# EAGLE design EHcircuit_v3.1 (EAGLE 9.1.0)
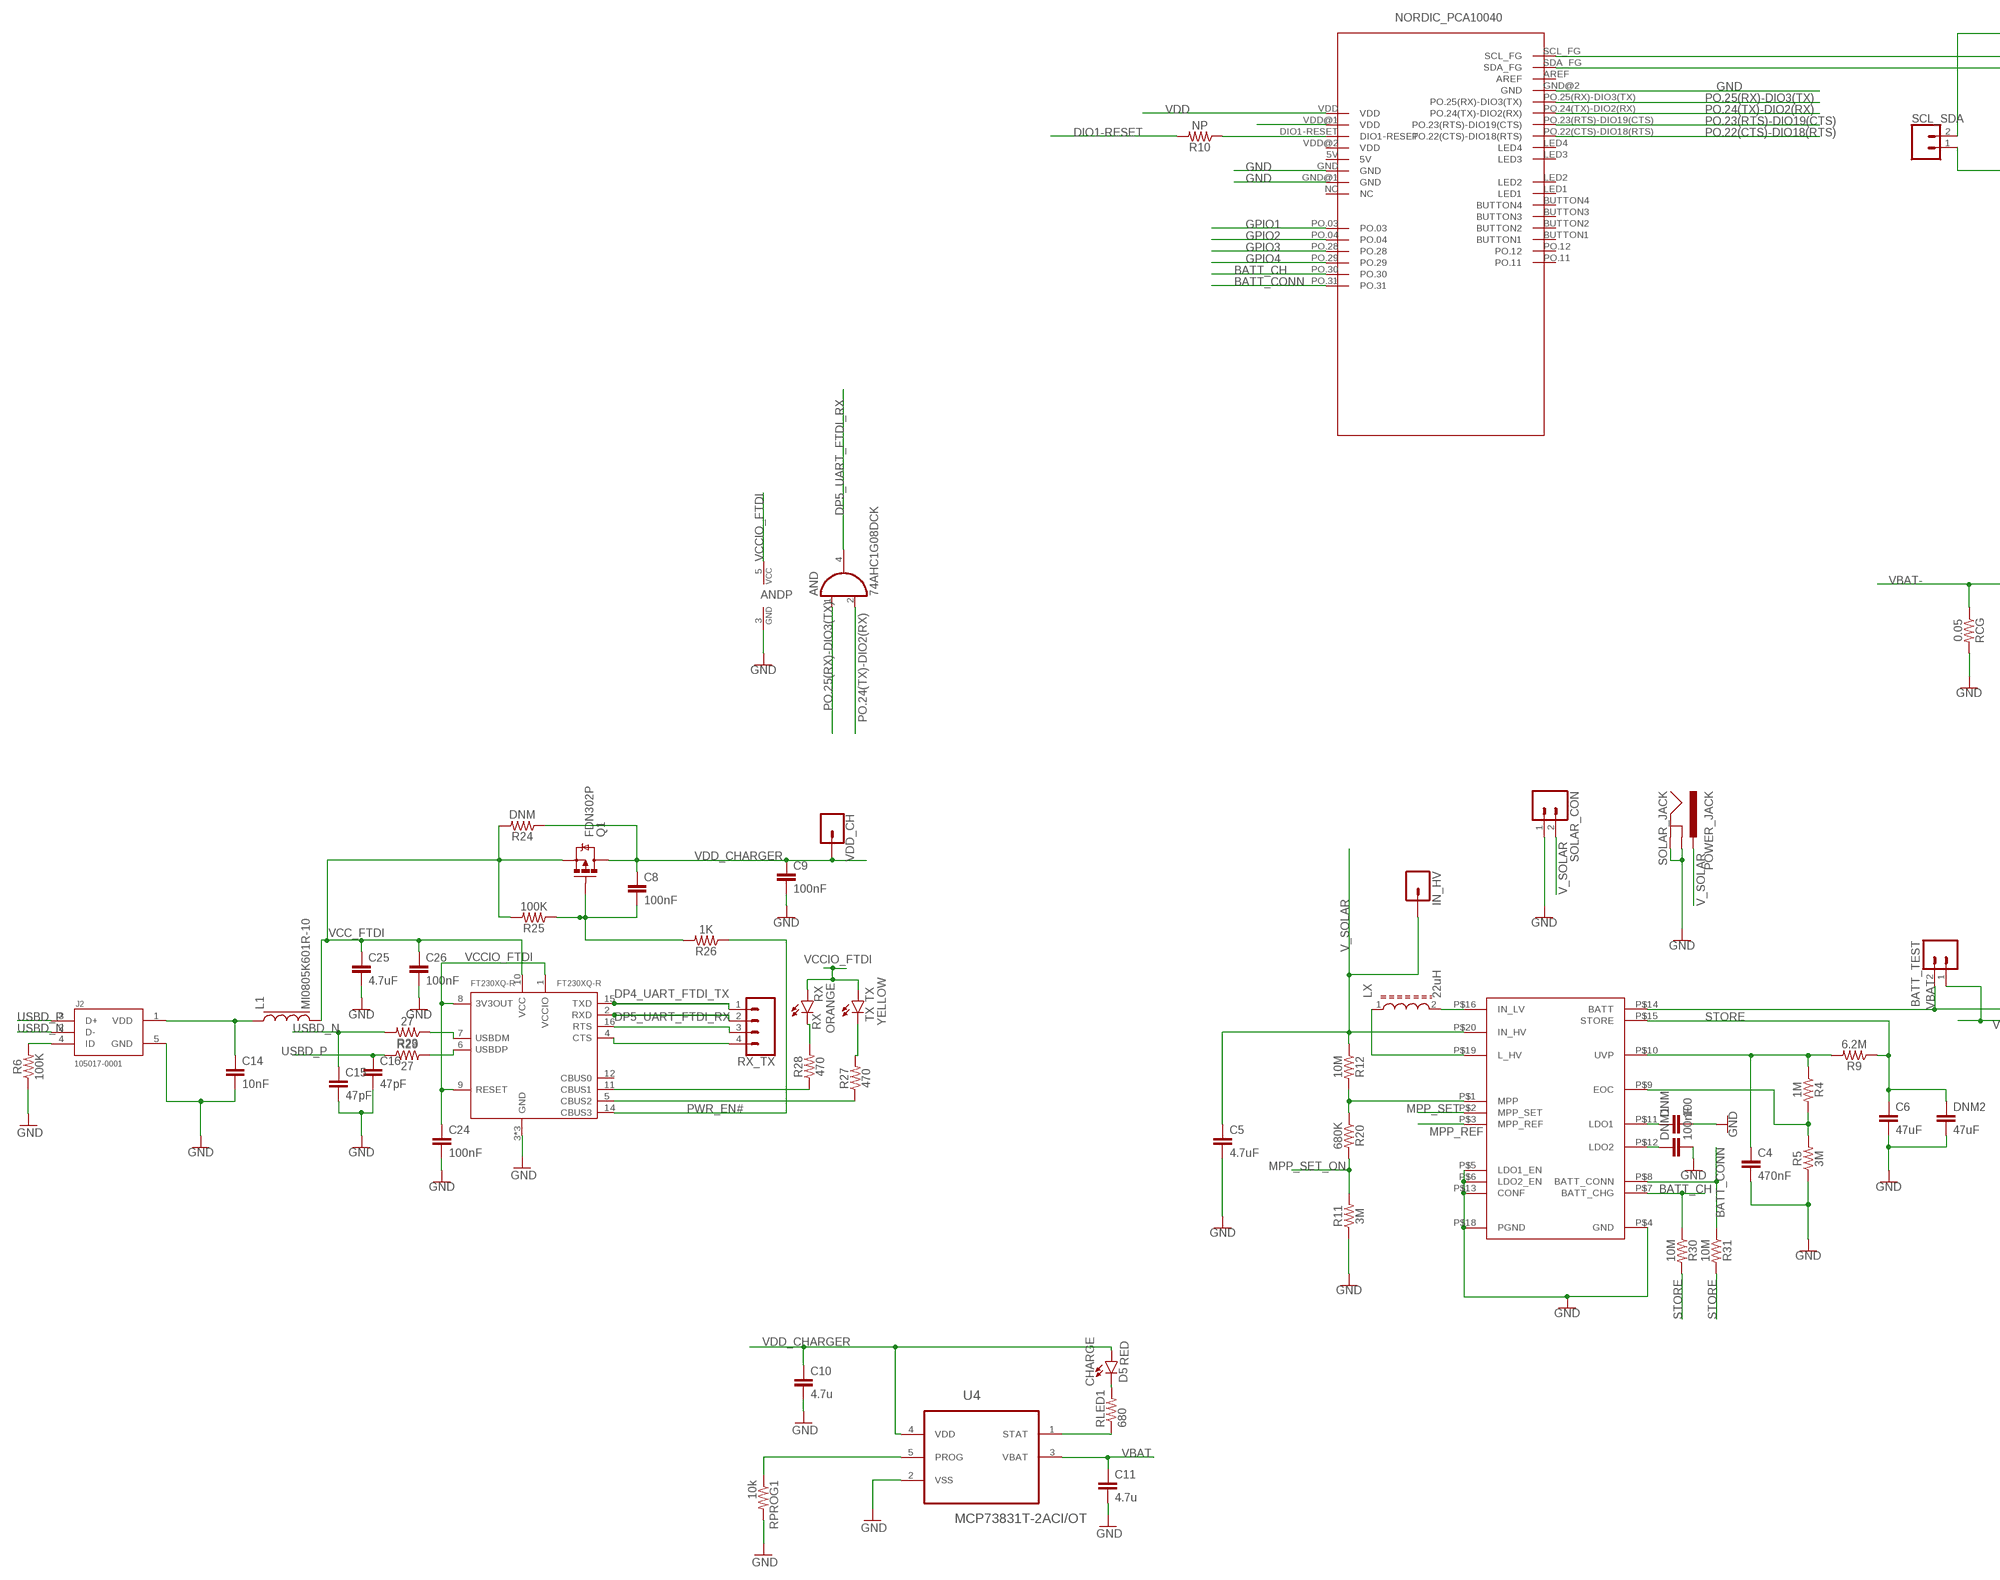
[diagram p0: schematic, sheet 1, part 1 of 2]
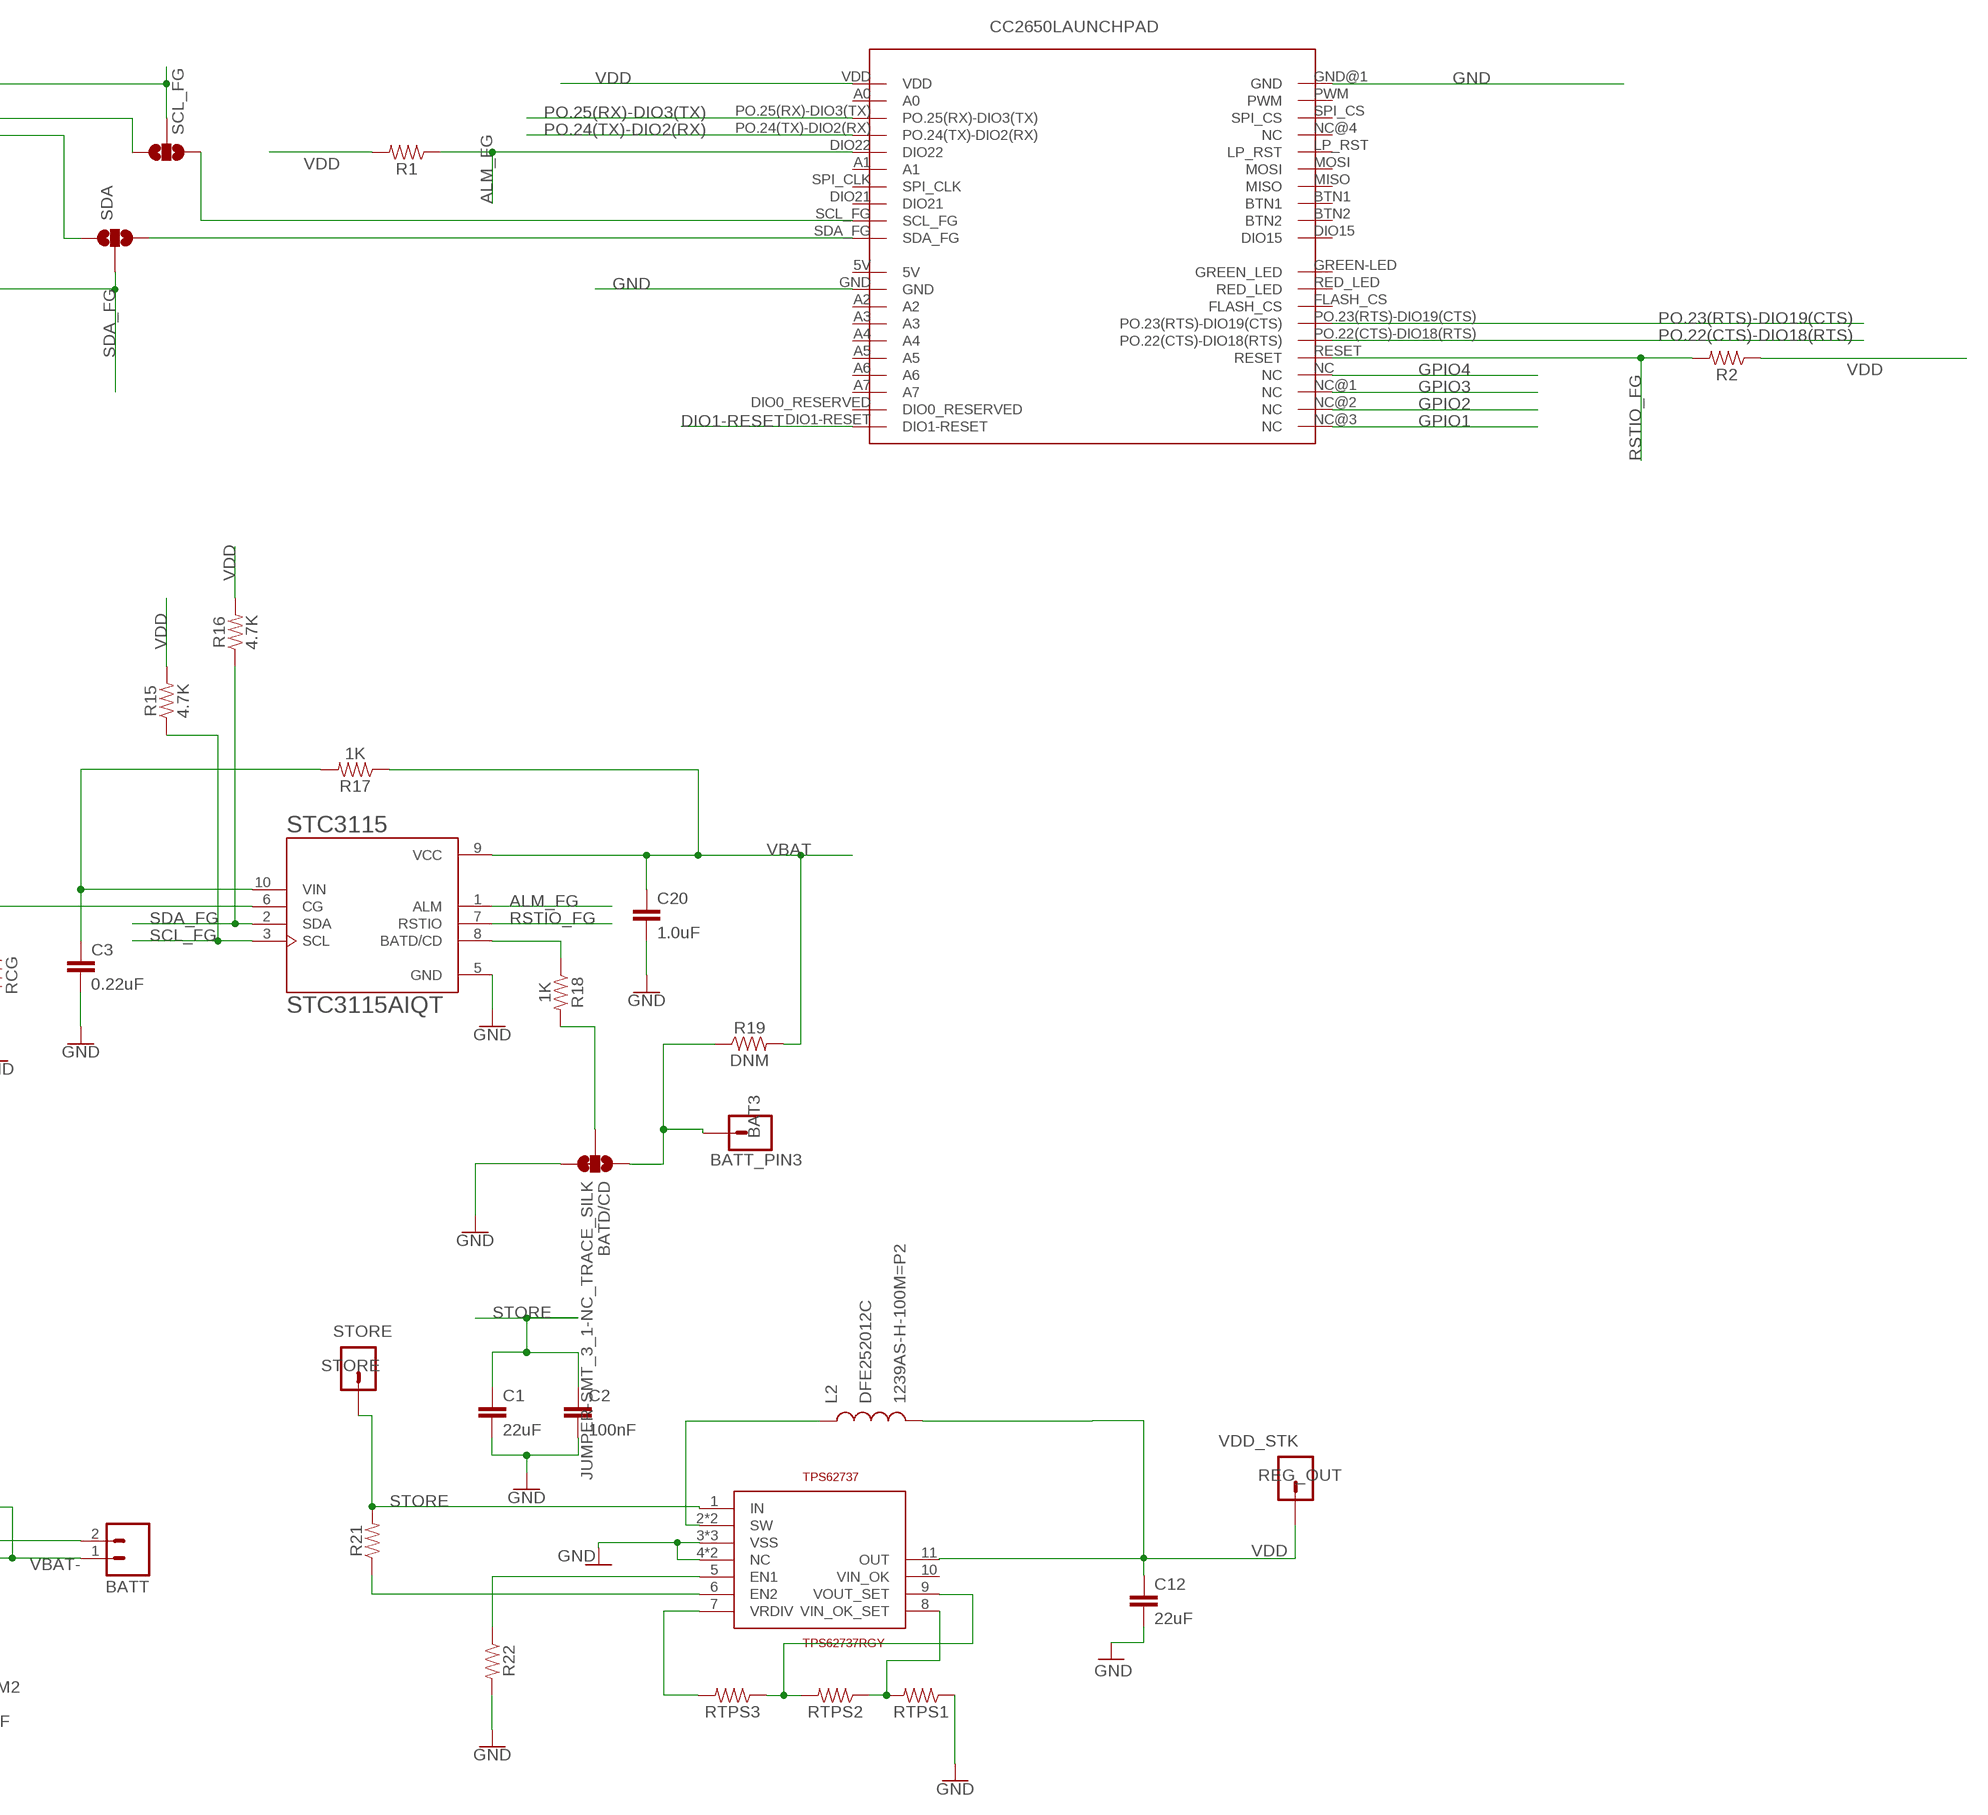
[diagram p1: schematic, sheet 1, part 2 of 2]

## Parts
AND  74AHC1G08DCK  [SC70-5]
BAT3  M01PTH  [1X01]
BATD/CD  JUMPER-SMT_3_1-NC_TRACE_SILK  [SMT-JUMPER_3_1-NC_TRACE_SILK]
BATT  M02-JST-2MM-SMT  [JST-2-SMD]
BATT_TEST  M02PTH  [1X02]
C1  22uF  10UF-0805-10V-10%  [0805@1]
C2  100nF  10UF-0805-10V-10%  [0805@1]
C3  0.22uF  10UF-0805-10V-10%  [0805@1]
C4  470nF  10UF-0805-10V-10%  [0805@1]
C5  4.7uF  10UF-0805-10V-10%  [0805@1]
C6  47uF  10UF-0805-10V-10%  [0805@1]
C8  100nF  10UF-0805-10V-10%  [0805@1]
C9  100nF  10UF-0805-10V-10%  [0805@1]
C10  4.7u  CAP0603-CAP  [0603-CAP]
C11  4.7u  CAP0603-CAP  [0603-CAP]
C12  22uF  10UF-0805-10V-10%  [0805@1]
C14  10nF  10UF-0805-10V-10%  [0805@1]
C15  47pF  10UF-0805-10V-10%  [0805@1]
C16  47pF  10UF-0805-10V-10%  [0805@1]
C20  1.0uF  10UF-0805-10V-10%  [0805@1]
C24  100nF  10UF-0805-10V-10%  [0805@1]
C25  4.7uF  10UF-0805-10V-10%  [0805@1]
C26  100nF  10UF-0805-10V-10%  [0805@1]
D5  RED  LED0603  [LED-0603]
DNM  100  10UF-0805-10V-10%  [0805@1]
DNM1  100nF  10UF-0805-10V-10%  [0805@1]
DNM2  47uF  10UF-0805-10V-10%  [0805@1]
FT230XQ-R  FT230XQ-R  FT230XQ_2  [QFN16]
IN_HV  M01PTH  [1X01]
J2  105017-0001  [MOLEX_105017-0001]
L1  MI0805K601R-10  FERRITE_BREAD  [0805]
L2  1239AS-H-100M=P2  DFE252012C  [DFE252012C]
LX  22uH  SRN4018-150M  [INDP4040X180N]
Q1  FDN302P  [SOT23-3]
R1  0.3OHM-0805-1/8W-1%  [0805@1]
R2  0.3OHM-0805-1/8W-1%  [0805@1]
R4  1M  0.3OHM-0805-1/8W-1%  [0805@1]
R5  3M  0.3OHM-0805-1/8W-1%  [0805@1]
R6  100K  0.3OHM-0805-1/8W-1%  [0805@1]
R9  6.2M  0.3OHM-0805-1/8W-1%  [0805@1]
R10  NP  0.3OHM-0805-1/8W-1%  [0805@1]
R11  3M  0.3OHM-0805-1/8W-1%  [0805@1]
R12  10M  0.3OHM-0805-1/8W-1%  [0805@1]
R15  4.7K  0.3OHM-0805-1/8W-1%  [0805@1]
R16  4.7K  0.3OHM-0805-1/8W-1%  [0805@1]
R17  1K  0.3OHM-0805-1/8W-1%  [0805@1]
R18  1K  0.3OHM-0805-1/8W-1%  [0805@1]
R19  DNM  0.3OHM-0805-1/8W-1%  [0805@1]
R20  680K  0.3OHM-0805-1/8W-1%  [0805@1]
R21  0.3OHM-0805-1/8W-1%  [0805@1]
R22  0.3OHM-0805-1/8W-1%  [0805@1]
R23  27  0.3OHM-0805-1/8W-1%  [0805@1]
R24  DNM  0.3OHM-0805-1/8W-1%  [0805@1]
R25  100K  0.3OHM-0805-1/8W-1%  [0805@1]
R26  1K  0.3OHM-0805-1/8W-1%  [0805@1]
R27  470  0.3OHM-0805-1/8W-1%  [0805@1]
R28  470  0.3OHM-0805-1/8W-1%  [0805@1]
R29  27  0.3OHM-0805-1/8W-1%  [0805@1]
R30  10M  0.3OHM-0805-1/8W-1%  [0805@1]
R31  10M  0.3OHM-0805-1/8W-1%  [0805@1]
RB2  CC2650LAUNCHPAD  [SEPS_RB]
RCG  0.05  0.3OHM-0805-1/8W-1%  [0805@1]
REG_OUT  M01PTH  [1X01]
RLED1  680  RESISTOR0603-RES  [0603-RES]
RPROG1  10k  RESISTOR0603-RES  [0603-RES]
RTPS1  0.3OHM-0805-1/8W-1%  [0805@1]
RTPS2  0.3OHM-0805-1/8W-1%  [0805@1]
RTPS3  0.3OHM-0805-1/8W-1%  [0805@1]
RX  ORANGE  LED0603  [LED-0603]
RX_TX  CONN_04  [1X04]
SCL  JUMPER-SMT_3_0_SILK  [SMT-JUMPER_3_0_NC_TRACE_SILK]
SCL_SDA  CONN_02  [1X02@2]
SDA  JUMPER-SMT_3_0_SILK  [SMT-JUMPER_3_0_NC_TRACE_SILK]
SOLAR_CON  M023.5MM  [SCREWTERMINAL-3.5MM-2]
SOLAR_JACK  POWER_JACK  [POWER_JACK_PTH]
SPV1050  SPV1050  [SPV1050]
STC3115  STC3115AIQT  [SON50P200X300X60-10]
STORE  M01PTH  [1X01]
TPS62737  TPS62737RGY  [QFN14]
TX  YELLOW  LED0603  [LED-0603]
U4  MCP73831T-2ACI/OT  [SOT95P280X145-5N]
U$1  PCA10040NORDIC  [SEPS_BB]
VDD_CH  CONN_01  [1X01@2]

## Nets
ALM_FG: R1.1 RB2.DIO22 STC3115.1(ALM)
BATT_CH: R30.1 SPV1050.P$7(BATT_CHG) U$1.PO.30
BATT_CONN: R31.1 SPV1050.P$8(BATT_CONN) U$1.PO.31
CHARGER_STAT1: RLED1.1 U4.1(STAT)
DIO1-RESET: R10.2 RB2.DIO1-RESET
DP4_UART_FTDI_TX: FT230XQ-R.15(TXD) RX_TX.1
DP5_UART_FTDI_RX: AND.4(O) FT230XQ-R.2(RXD) RX_TX.2
GND: AND.3(GND) BATD/CD.3 C1.2 C2.2 C3.2 C4.2 C5.2 C6.2 C9.2 C10.2 C11.2 C12.2 C14.2 C15.2 C16.2 C20.2 C24.2 C25.2 C26.2 DNM1.2 DNM2.2 DNM.2 FT230XQ-R.3(GND) FT230XQ-R.13(GND) FT230XQ-R.17(GND) J2.5(GND) R5.1 R6.1 R11.1 R22.2 RB2.GND RB2.GND@1(GND) RCG.2 RPROG1.2 RTPS1.1 SOLAR_CON.1 SOLAR_JACK.GND SOLAR_JACK.GNDBREAK SPV1050.P$4(GND) SPV1050.P$5(LDO1_EN) SPV1050.P$6(LDO2_EN) SPV1050.P$13(CONF) SPV1050.P$18(PGND) STC3115.5(GND) TPS62737.3(VSS) TPS62737.4(NC) TPS62737.12(VSS) TPS62737.14(NC) TPS62737.TH_PAD(VSS) U4.2(VSS) U$1.GND U$1.GND@1(GND) U$1.GND@2(GND)
GPIO1: RB2.NC@3(NC) U$1.PO.03
GPIO2: RB2.NC@2(NC) U$1.PO.04
GPIO3: RB2.NC@1(NC) U$1.PO.28
GPIO4: RB2.NC U$1.PO.29
MPP_REF: SPV1050.P$3(MPP_REF)
MPP_SET: SPV1050.P$2(MPP_SET)
MPP_SET_ON: R11.2 R20.2
N$1: FT230XQ-R.11(CBUS1) R28.1
N$2: C14.1 J2.1(VDD) L1.1
N$3: C8.2 Q1.1(G) R25.1 R26.2
N$4: RTPS1.2 RTPS2.1 TPS62737.8(VIN_OK_SET)
N$5: R18.1 STC3115.8(BATD/CD)
N$6: R22.1 TPS62737.5(EN1)
N$7: LX.2 SPV1050.P$16(IN_LV)
N$8: R12.2 R20.1 SPV1050.P$1(MPP)
N$9: LX.1 SPV1050.P$19(L_HV)
N$10: R21.1 TPS62737.6(EN2)
N$11: L2.P$1 TPS62737.2(SW) TPS62737.13(SW)
N$12: RB2.SCL_FG SCL.1
N$13: U$1.VDD@1(VDD)
N$14: FT230XQ-R.5(CBUS2) R27.1
N$17: RPROG1.1 U4.5(PROG)
N$18: J2.4(ID) R6.2
N$20: R28.2 RX.C
N$21: R10.1 U$1.DIO1-RESET
N$22: RTPS3.2 TPS62737.7(VRDIV)
N$23: RB2.SDA_FG SDA.3
N$24: R27.2 TX.C
N$25: BATD/CD.2 R18.2
N$26: RTPS2.2 RTPS3.1 TPS62737.9(VOUT_SET)
N$27: SDA.1 U$1.SDA_FG
N$28: SCL.3 U$1.SCL_FG
N$29: BAT3.1 BATD/CD.1 R19.1
N$30: D5.C RLED1.2
N$31: FT230XQ-R.7(USBDM) R23.1
N$32: FT230XQ-R.6(USBDP) R29.2
N$33: FT230XQ-R.16(RTS) RX_TX.3
N$34: C3.1 R17.2 STC3115.10(VIN)
N$35: FT230XQ-R.4(CTS) RX_TX.4
N$40: C4.1 R4.1 R9.2 SPV1050.P$10(UVP)
N$41: R4.2 R5.2 SPV1050.P$9(EOC)
N$44: DNM.1 SPV1050.P$11(LDO1)
N$45: DNM1.1 SPV1050.P$12(LDO2)
PO.22(CTS)-DIO18(RTS): RB2.PO.22(CTS)-DIO18(RTS) U$1.PO.22(CTS)-DIO18(RTS)
PO.23(RTS)-DIO19(CTS): RB2.PO.23(RTS)-DIO19(CTS) U$1.PO.23(RTS)-DIO19(CTS)
PO.24(TX)-DIO2(RX): AND.2(I1) RB2.PO.24(TX)-DIO2(RX) U$1.PO.24(TX)-DIO2(RX)
PO.25(RX)-DIO3(TX): AND.1(I0) RB2.PO.25(RX)-DIO3(TX) U$1.PO.25(RX)-DIO3(TX)
PWR_EN#: FT230XQ-R.14(CBUS3) R26.1
RSTIO_FG: R2.2 RB2.RESET STC3115.7(RSTIO)
SCL_FG: R15.1 SCL.2 SCL_SDA.2 STC3115.3(SCL)
SDA_FG: R16.1 SCL_SDA.1 SDA.2 STC3115.2(SDA)
STORE: C1.1 C2.1 C6.1 DNM2.1 R9.1 R21.2 R30.2 R31.2 SPV1050.P$15(STORE) STORE.1 TPS62737.1(IN)
USBD_N: C15.1 J2.2(D-) R23.2
USBD_P: C16.1 J2.3(D+) R29.1
V_SOLAR: C5.1 IN_HV.1 R12.1 SOLAR_CON.2 SOLAR_JACK.PWR SPV1050.P$20(IN_HV)
VBAT: BATT.2 BATT_TEST.2 C11.1 C20.1 R17.1 R19.2 SPV1050.P$14(BATT) STC3115.9(VCC) U4.3(VBAT)
VBAT-: BATT.1 BATT_TEST.1 RCG.1 STC3115.6(CG)
VCC_FTDI: C25.1 C26.1 FT230XQ-R.10(VCC) L1.2 Q1.2(S) R24.2 R25.2
VCCIO_FTDI: AND.5(VCC) C24.1 FT230XQ-R.1(VCCIO) FT230XQ-R.8(3V3OUT) FT230XQ-R.9(RESET) RX.A TX.A
VDD: C12.1 L2.P$2 R1.2 R2.1 R15.2 R16.2 RB2.VDD REG_OUT.1 TPS62737.11(OUT) U$1.VDD
VDD_CHARGER: C8.1 C9.1 C10.1 D5.A Q1.3(D) R24.1 U4.4(VDD) VDD_CH.1
Unconnected: FT230XQ-R.12(CBUS0) RB2.5V RB2.A0 RB2.A1 RB2.A2 RB2.A3 RB2.A4 RB2.A5 RB2.A6 RB2.A7 RB2.BTN1 RB2.BTN2 RB2.DIO0_RESERVED RB2.DIO15 RB2.DIO21 RB2.FLASH_CS RB2.GREEN-LED(GREEN_LED) RB2.LP_RST RB2.MISO RB2.MOSI RB2.NC@4(NC) RB2.PWM RB2.RED_LED RB2.SPI_CLK RB2.SPI_CS TPS62737.10(VIN_OK) U$1.5V U$1.AREF U$1.BUTTON1 U$1.BUTTON2 U$1.BUTTON3 U$1.BUTTON4 U$1.LED1 U$1.LED2 U$1.LED3 U$1.LED4 U$1.NC U$1.PO.11 U$1.PO.12 U$1.VDD@2(VDD)

## Library data of the parts
AND = 74xx-little-de:74*1G08: 2-input AND gate
BAT3 = SparkFun-Connectors:M01: Header 1 Standard 1-pin 0.1" header. Use with straight break away headers (SKU : PRT-00116), right angle break away headers (PRT-00553), swiss pins (PRT-00743), machine pins (PRT-00117), and female headers (PRT-00115). SMTSO-256-ET is a "flush mount" nut for a 4-40 screw. The older package used to be too tight, and did not allow it to sit properly thru the drill hit. The latest (0.165DIA) fits nice and snug.; LABEL: BATT_PIN3
BATD/CD = SparkFun-Jumpers:JUMPER-SMT_3_1-NC_TRACE: Normally closed trace jumper (1 of 2 connections) This jumper has a trace between two pads so it's normally closed (NC). The other connection is normally open (NO). Use a razor knife to open the connection. For best results follow the IPC guidelines for cutting traces: Cutout at least 0.063 mm (0.005 in). Remove all loose material to clean up the cut area. Seal the cut with an approved epoxy. Reapply solder to reclose the connection, or to close the NO connection.
BATT = SparkFun-Connectors:M02: Standard 2-pin 0.1" header. Use with - straight break away headers ( PRT-00116) - right angle break away headers (PRT-00553) - swiss pins (PRT-00743) - machine pins (PRT-00117) - female headers (PRT-00115) Molex polarized connector foot print use with: PRT-08233 with associated crimp pins and housings. 2.54_SCREWTERM for use with PRT-10571. 3.5mm Screw Terminal footprints for PRT-08084 5mm Screw Terminal footprints for use with PRT-08432; PROD_ID: CONN-11443
BATT_TEST = SparkFun-Connectors:M02: Standard 2-pin 0.1" header. Use with - straight break away headers ( PRT-00116) - right angle break away headers (PRT-00553) - swiss pins (PRT-00743) - machine pins (PRT-00117) - female headers (PRT-00115) Molex polarized connector foot print use with: PRT-08233 with associated crimp pins and housings. 2.54_SCREWTERM for use with PRT-10571. 3.5mm Screw Terminal footprints for PRT-08084 5mm Screw Terminal footprints for use with PRT-08432
C1-C6 C8 C9 C12 C14-C16 C20 C24-C26 DNM DNM1 DNM2 = SparkFun-Capacitors:10UF: 10.0µF ceramic capacitors A capacitor is a passive two-terminal electrical component used to store electrical energy temporarily in an electric field.; PROD_ID: CAP-11330; VALUE: 10uF
C10 C11 = SparkFun-Capacitors:CAP: Capacitor Standard 0603 ceramic capacitor, and 0.1" leaded capacitor.
D5 = SparkFun-LED:LED: LEDs Standard schematic elements and footprints for 5mm, 3mm, 1206, and 0603 sized LEDs. 5mm - Spark Fun Electronics SKU : COM-00529 (and others); COLOR: RED; FUNCTION: CHARGE
FT230XQ-R = FT230XQ:FT230XQ_2
IN_HV = SparkFun-Connectors:M01: Header 1 Standard 1-pin 0.1" header. Use with straight break away headers (SKU : PRT-00116), right angle break away headers (PRT-00553), swiss pins (PRT-00743), machine pins (PRT-00117), and female headers (PRT-00115). SMTSO-256-ET is a "flush mount" nut for a 4-40 screw. The older package used to be too tight, and did not allow it to sit properly thru the drill hit. The latest (0.165DIA) fits nice and snug.
J2 = 105017-0001:105017-0001; AVAILABILITY: Good; DESCRIPTION: Conn USB Type B M 5 POS 0.65mm Solder RA Thru-Hole 5 Terminal 1 Port Embossed T/R; MF: Molex; MP: 105017-0001; PACKAGE: None; PRICE: 0.49 USD
L1 = davide:FERRITE_BREAD
L2 = davide:DFE252012C; MODEL: DFE252012C
LX = SRN4018-150M:SRN4018-150M: Inductor Power Semi-Shielded Wirewound 47uH 20% 100KHz Ferrite 600mA 780mOhm DCR 1515 T/R; AVAILABILITY: Good; DESCRIPTION: Inductor Power Semi-Shielded Wirewound 15uH 20% 100KHz Ferrite 1A 264mOhm DCR 1515 T/R; MF: Bourns; MP: SRN4018-150M; PACKAGE: Nonstandard Bourns; PRICE: 0.19 USD
Q1 = davide:FDN302P
R1 R2 R4-R6 R9-R12 R15-R31 RCG RTPS1-RTPS3 = SparkFun-Resistors:0.3OHM: 0.3Ω resistor A resistor is a passive two-terminal electrical component that implements electrical resistance as a circuit element. Resistors act to reduce current flow, and, at the same time, act to lower voltage levels within circuits. - Wikipedia; PROD_ID: RES-11622; VALUE: 0.3
RB2 = powersol:CC2650LAUNCHPAD: CC2650 LaunchPad
REG_OUT = SparkFun-Connectors:M01: Header 1 Standard 1-pin 0.1" header. Use with straight break away headers (SKU : PRT-00116), right angle break away headers (PRT-00553), swiss pins (PRT-00743), machine pins (PRT-00117), and female headers (PRT-00115). SMTSO-256-ET is a "flush mount" nut for a 4-40 screw. The older package used to be too tight, and did not allow it to sit properly thru the drill hit. The latest (0.165DIA) fits nice and snug.; LABEL: VDD_STK
RLED1 RPROG1 = SparkFun-Passives:RESISTOR: Resistor Basic schematic elements and footprints for 0603, 1206, and PTH resistors.
RX = SparkFun-LED:LED: LEDs Standard schematic elements and footprints for 5mm, 3mm, 1206, and 0603 sized LEDs. 5mm - Spark Fun Electronics SKU : COM-00529 (and others); COLOR: ORANGE; FUNCTION: RX
RX_TX = SparkFun-Connectors:CONN_04: Multi connection point. Often used as Generic Header-pin footprint for 0.1 inch spaced/style header connections On any of the 0.1 inch spaced packages, you can populate with these: Break Away Headers - Straight <https://www.sparkfun.com/products/116> (PRT-00116) Break Away Male Headers - Right Angle <https://www.sparkfun.com/products/553> (PRT-00553) Female Headers <https://www.sparkfun.com/products/115> (PRT-00115) Break Away Headers - Machine Pin <https://www.sparkfun.com/products/117> (PRT-00117) Break Away Female Headers - Swiss Machine Pin <https://www.sparkfun.com/products/743> (PRT-00743) For SCREWTERMINALS and SPRING TERMINALS visit here: Screw Terimnals on SparkFun.com <https://www.sparkfun.com/search/results?term=Screw+Terminals> (5mm/3.5mm/2.54mm spacing) This device is also useful as a general connection point to wire up your design to another part of your project. Our various solder wires solder well into these plated through hole pads. Hook-Up Wire - Assortment (Stranded, 22 AWG) <https://www.sparkfun.com/products/11375> (PRT-11375) Hook-Up Wire - Assortment (Solid Core, 22 AWG) <https://www.sparkfun.com/products/11367> (PRT-11367) View the entire wire category on our website here <https://www.sparkfun.com/categories/141> Special notes: Molex polarized connector foot print use with SKU : PRT-08231 with associated crimp pins and housings. 1MM SMD Version SKU: PRT-10208; PROD_ID: CONN-09696
SCL SDA = powersol:JUMPER-SMT_3_0_SILK
SCL_SDA = SparkFun-Connectors:CONN_02: Multi connection point. Often used as Generic Header-pin footprint for 0.1 inch spaced/style header connections On any of the 0.1 inch spaced packages, you can populate with these: Break Away Headers - Straight <https://www.sparkfun.com/products/116> (PRT-00116) Break Away Male Headers - Right Angle <https://www.sparkfun.com/products/553> (PRT-00553) Female Headers <https://www.sparkfun.com/products/115> (PRT-00115) Break Away Headers - Machine Pin <https://www.sparkfun.com/products/117> (PRT-00117) Break Away Female Headers - Swiss Machine Pin <https://www.sparkfun.com/products/743> (PRT-00743) For SCREWTERMINALS and SPRING TERMINALS visit here: Screw Terimnals on SparkFun.com <https://www.sparkfun.com/search/results?term=Screw+Terminals> (5mm/3.5mm/2.54mm spacing) This device is also useful as a general connection point to wire up your design to another part of your project. Our various solder wires solder well into these plated through hole pads. Hook-Up Wire - Assortment (Stranded, 22 AWG) <https://www.sparkfun.com/products/11375> (PRT-11375) Hook-Up Wire - Assortment (Solid Core, 22 AWG) <https://www.sparkfun.com/products/11367> (PRT-11367) View the entire wire category on our website here <https://www.sparkfun.com/categories/141> Special notes: Molex polarized connector foot print use with: PRT-08233 with associated crimp pins and housings. 2.54_SCREWTERM for use with PRT-10571. 3.5mm Screw Terminal footprints for PRT-08084 5mm Screw Terminal footprints for use with PRT-08432
SOLAR_CON = SparkFun-Connectors:M02: Standard 2-pin 0.1" header. Use with - straight break away headers ( PRT-00116) - right angle break away headers (PRT-00553) - swiss pins (PRT-00743) - machine pins (PRT-00117) - female headers (PRT-00115) Molex polarized connector foot print use with: PRT-08233 with associated crimp pins and housings. 2.54_SCREWTERM for use with PRT-10571. 3.5mm Screw Terminal footprints for PRT-08084 5mm Screw Terminal footprints for use with PRT-08432; PROD_ID: CONN-08399
SOLAR_JACK = SparkFun-Connectors:POWER_JACK: Power Jack Connector This is the standard 5.5mm barrel jack for power. The PTH is the most common, proven, reliable, footprint. The Slot footprint only works if the mill layer is transmitted to the PCB fab house so be warned. Here are the connectors we sell at SparkFun: DC Barrel Power Jack/Connector <https://www.sparkfun.com/products/119> (PRT-00119) DC Barrel Power Jack/Connector (SMD) <https://www.sparkfun.com/products/12748> (PRT-12748) DC Barrel Jack Adapter - Breadboard Compatible <https://www.sparkfun.com/products/10811> (PRT-10811) It is used on this SparkFun product (and many, many others): SparkFun RedBoard - Programmed with Arduino <https://www.sparkfun.com/products/12757> (DEV-12757) Also, if you need a mating power supply or connector, please check these out: Wall Adapter Power Supply - 9VDC 650mA <https://www.sparkfun.com/products/298> (TOL-00298) DC Barrel Jack Adapter - Male <https://www.sparkfun.com/products/10287> (PRT-10287); PROD_ID: CONN-08197
SPV1050 = STM-SPV1050:SPV1050
STC3115 = STC3115AIQT:STC3115AIQT: STC3115 2.7 V -4.5 V Series Gas gauge IC alarm out for handheld apps-10-DFN; AVAILABILITY: Good; DESCRIPTION: STC3115 2.7 V -4.5 V Series Gas gauge IC alarm out for handheld apps-10-DFN; MF: STMicroelectronics; MP: STC3115AIQT; PACKAGE: DFN-10 STMicroelectronics; PRICE: 1.70 USD
STORE = SparkFun-Connectors:M01: Header 1 Standard 1-pin 0.1" header. Use with straight break away headers (SKU : PRT-00116), right angle break away headers (PRT-00553), swiss pins (PRT-00743), machine pins (PRT-00117), and female headers (PRT-00115). SMTSO-256-ET is a "flush mount" nut for a 4-40 screw. The older package used to be too tight, and did not allow it to sit properly thru the drill hit. The latest (0.165DIA) fits nice and snug.; LABEL: STORE
TPS62737 = davide:TPS62737RGY
TX = SparkFun-LED:LED: LEDs Standard schematic elements and footprints for 5mm, 3mm, 1206, and 0603 sized LEDs. 5mm - Spark Fun Electronics SKU : COM-00529 (and others); COLOR: YELLOW; FUNCTION: TX
U4 = MCP73831T-2ACI_OT:MCP73831T-2ACI/OT: Charge Management Controller; AVAILABILITY: Good; DESCRIPTION: MCP73831 Series Single-Cell Li-Ion/Li-Polymer Battery Charge Controller SOT-23-5; MF: Microchip; MP: MCP73831T-2ACI/OT; PACKAGE: SOT-23 Microchip; PRICE: 0.51 USD
U$1 = powersol:PCA10040NORDIC: Blue Board
VDD_CH = SparkFun-Connectors:CONN_01: Single connection point. Often used as Generic Header-pin footprint for 0.1 inch spaced/style header connections On any of the 0.1 inch spaced packages, you can populate with these: Break Away Headers - Straight <https://www.sparkfun.com/products/116> (PRT-00116) Break Away Male Headers - Right Angle <https://www.sparkfun.com/products/553> (PRT-00553) Female Headers <https://www.sparkfun.com/products/115> (PRT-00115) Break Away Headers - Machine Pin <https://www.sparkfun.com/products/117> (PRT-00117) Break Away Female Headers - Swiss Machine Pin <https://www.sparkfun.com/products/743> (PRT-00743) This device is also useful as a general connection point to wire up your design to another part of your project. Our various solder wires solder well into these plated through hole pads. Hook-Up Wire - Assortment (Stranded, 22 AWG) <https://www.sparkfun.com/products/11375> (PRT-11375) Hook-Up Wire - Assortment (Solid Core, 22 AWG) <https://www.sparkfun.com/products/11367> (PRT-11367) View the entire wire category on our website here <https://www.sparkfun.com/categories/141> Special notes: SMTSO-256-ET is a "flush mount" nut for a 4-40 screw. We mostly use this on specialty testbeds; it is a nice way to connect hardware to your PCB at an adjustable hieght. Also note, the SNAP packages are for using a snappable style connector. We sell a baggie of snaps and they are also used on two LilyPad designs: Snap Assortment - 30 pack (male and female) <https://www.sparkfun.com/products/11347> (DEV-11347) LilyPad Arduino SimpleSnap <https://www.sparkfun.com/products/10941> (DEV-10941) LilyPad SimpleSnap Protoboard <https://www.sparkfun.com/products/10940> (DEV-10940)

## Board
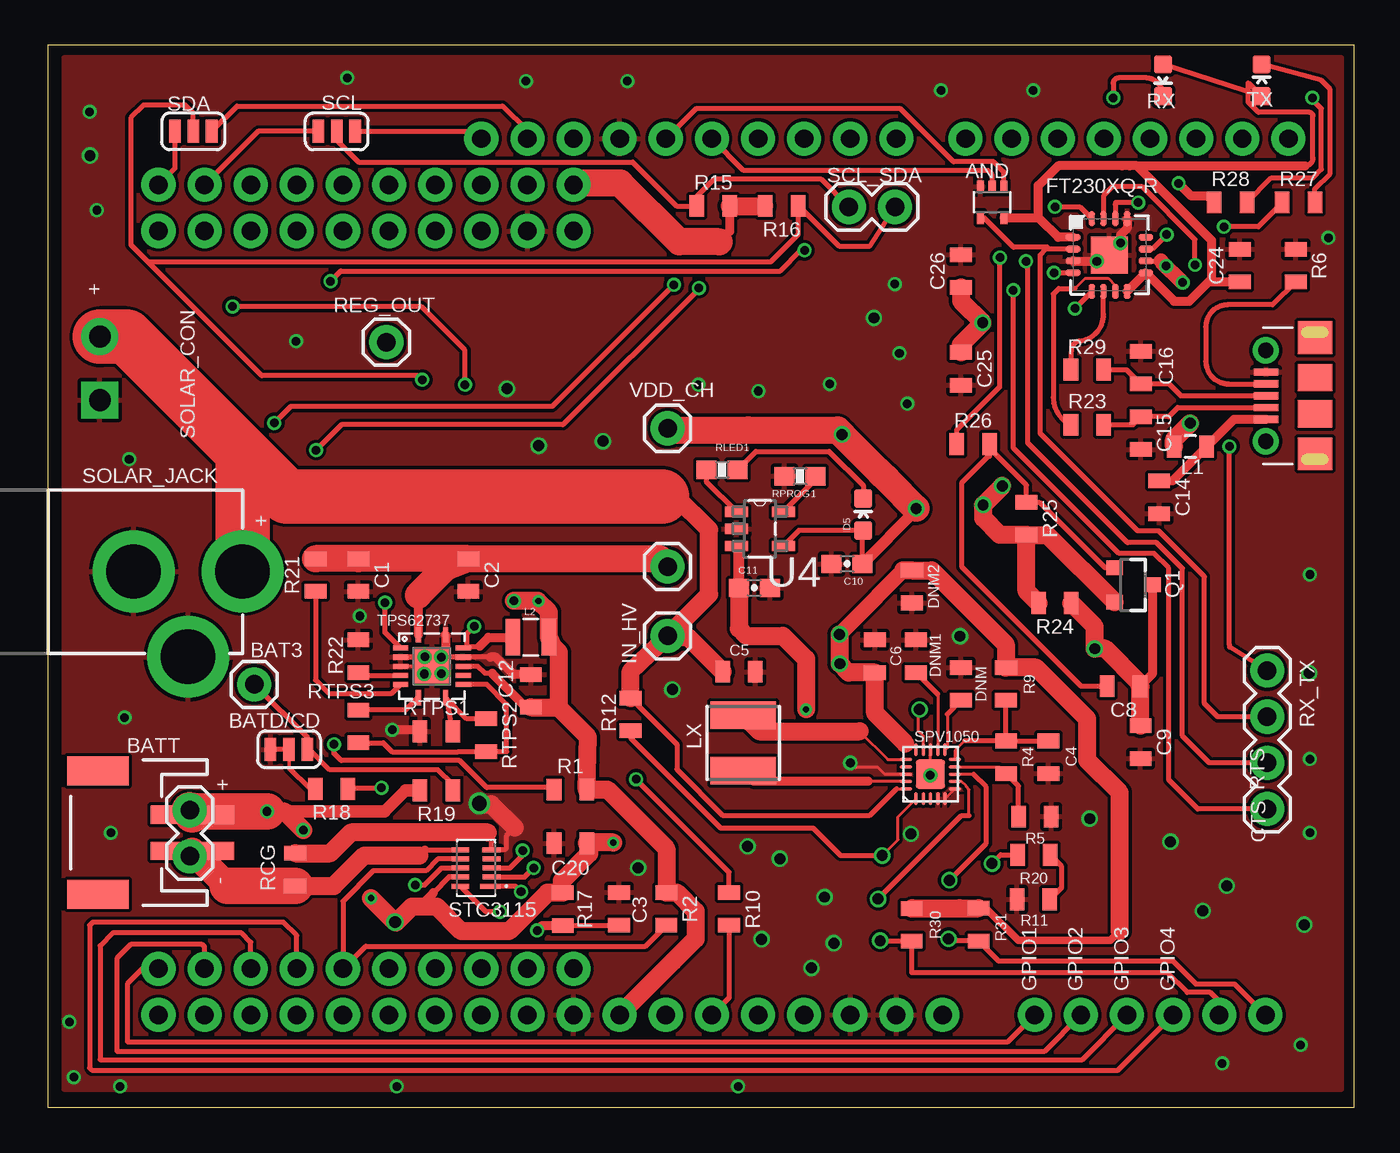
[diagram p2: board, top side]
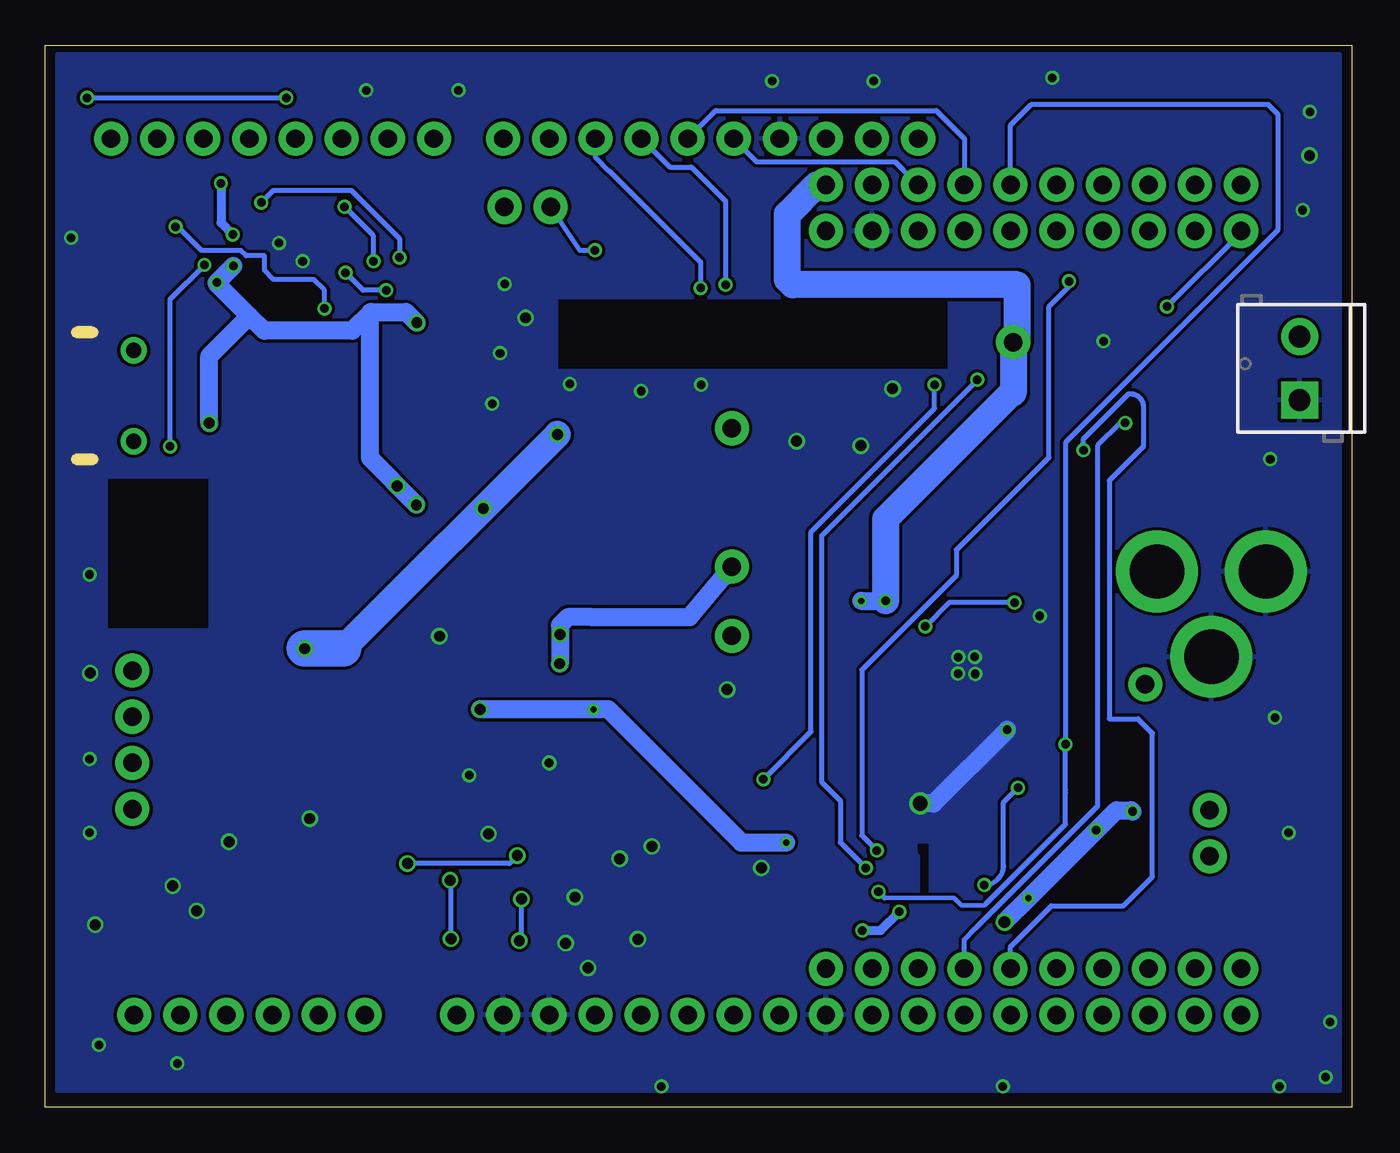
[diagram p3: board, bottom side, seen from below]

Size 71.94 x 58.48 mm. Coordinates in mm from the lower left corner, seen from the top.
Outline: 0,0 71.94,0 71.94,58.48 0,58.48 0,0
Copper layers (1*16): Top 0.018mm / dielectric 1.55mm / Bottom 0.018mm
Design rules "eC_2Layer_PClass5_BaseCopperO18": minimum track width 0.175mm, minimum drill 0.35mm, track to track 0.175mm, track to pad 0.175mm, pad to pad 0.175mm, via to via 0.175mm, smd to smd 0mil, copper to edge 0.25mm, drill to drill 0.35mm, minimum pad ring 0.2mm, minimum via ring 0.15mm, stop-mask expansion 0mil, vias tented up to drill 0.45mm, thermal gap 0.2mm

### Footprints (pad centres in the part's own frame; a part is rotated, then mirrored left to right if it is on the bottom)
SC70-5 = smd 0.4 x 0.7: 1 -0.65,-0.85; 2 0,-0.85; 3 0.65,-0.85; 4 0.65,0.85; 5 -0.65,0.85
1X01 = drill 1.016 pad 1.88: 1 0,0
SMT-JUMPER_3_1-NC_TRACE_SILK = smd 0.635 x 1.27: 1 -1.016,0; 2 0,0; 3 1.016,0
JST-2-SMD = smd 1 x 4.6: 1 -1,-3.7; 2 1,-3.7 | smd 1.6 x 3.4: NC1 -3.4,1.5; NC2 3.4,1.5
1X02 = drill 1.016 pad 1.88: 1 0,0; 2 2.54,0
0805@1 = smd 0.8 x 1.2: 1 -0.9,0; 2 0.9,0
0603-CAP = smd 1.1 x 1: 1 -0.85,0; 2 0.85,0
LED-0603 = smd 1 x 1: A 0,-0.877; C 0,0.877
QFN16 = smd 0.8 x 0.35: 1 -2,0.975; 2 -2,0.325; 3 -2,-0.325; 4 -2,-0.975; 9 2,-0.975; 10 2,-0.325; 11 2,0.325; 12 2,0.975 | smd 0.35 x 0.8: 5 -0.975,-2; 6 -0.325,-2; 7 0.325,-2; 8 0.975,-2; 13 0.975,2; 14 0.325,2; 15 -0.325,2; 16 -0.975,2 | smd 2.032 x 2.032: 17 0,0
MOLEX_105017-0001 = smd 0.4 x 1.35: 1 -1.3,2.675; 2 -0.65,2.675; 3 0,2.675; 4 0.65,2.675; 5 1.3,2.675 | drill 0.85 pad 1.45: P$1 -2.5,2.7; P$2 2.5,2.7 | smd 1.5 x 1.9: P$8 -1,0; P$9 1,0 | smd 1.8 x 1.9: P$10 -3.2,0; P$11 3.2,0
0805 = smd 0.8 x 1.2: 1 -0.9,0; 2 0.9,0
DFE252012C = smd 0.8 x 2: P$1 -1,0; P$2 1,0
INDP4040X180N = smd 1.5 x 3.6: 1 -1.525,0; 2 1.525,0
SOT23-3 = smd 0.8 x 0.9: 1 -0.95,-1; 2 0.95,-1; 3 0,1.1
SEPS_RB = drill 1.016 pad 1.88: 5V -24.257,-22.225; A0 -21.717,-24.765; A1 -11.557,-24.765; A2 -19.177,-22.225; A3 -16.637,-22.225; A4 -14.097,-22.225; A5 -11.557,-22.225; A6 -9.017,-22.225; A7 -6.477,-22.225; BTN1 -6.477,20.955; BTN2 -3.937,20.955; DIO0_RESERVED -3.937,-22.225; DIO1-RESET -1.397,-22.225; DIO15 -1.397,20.955; DIO21 -6.477,-24.765; DIO22 -14.097,-24.765; FLASH_CS -19.177,18.415; GND -21.717,-22.225; GND@1 -24.257,20.955; GREEN-LED -24.257,18.415; LP_RST -14.097,20.955; MISO -9.017,20.955; MOSI -11.557,20.955; NC -9.017,18.415; NC@1 -6.477,18.415; NC@2 -3.937,18.415; NC@3 -1.397,18.415; NC@4 -16.637,20.955; PO.22(CTS)-DIO18(RTS) -14.097,18.415; PO.23(RTS)-DIO19(CTS) -16.637,18.415; PO.24(TX)-DIO2(RX) -16.637,-24.765; PO.25(RX)-DIO3(TX) -19.177,-24.765; PWM -21.717,20.955; RED_LED -21.717,18.415; RESET -11.557,18.415; SCL_FG -3.937,-24.765; SDA_FG -1.397,-24.765; SPI_CLK -9.017,-24.765; SPI_CS -19.177,20.955; VDD -24.257,-24.765
0603-RES = smd 1.1 x 1: 1 -0.85,0; 2 0.85,0
1X04 = drill 1.016 pad 1.88: 1 0,0; 2 2.54,0; 3 5.08,0; 4 7.62,0
SMT-JUMPER_3_0_NC_TRACE_SILK = smd 0.635 x 1.27: 1 -1.016,0; 2 0,0; 3 1.016,0
1X02@2 = drill 1.016 pad 1.88: 1 0,0; 2 2.54,0
SCREWTERMINAL-3.5MM-2 = drill 1.2 pad 2.032 square: 1 0,0 | drill 1.2 pad 2.032: 2 3.5,0
POWER_JACK_PTH = drill 2.997 pad 4.318: GND 0,7.7; GNDBREAK 4.7,10.7; PWR 0,13.7
SPV1050 = smd 0.7 x 0.2: P$1 -1.35,0.8; P$2 -1.35,0.4; P$3 -1.35,0; P$4 -1.35,-0.4; P$5 -1.35,-0.8; P$11 1.35,-0.8; P$12 1.35,-0.4; P$13 1.35,0; P$14 1.35,0.4; P$15 1.35,0.8 | smd 0.2 x 0.7: P$6 -0.8,-1.35; P$7 -0.4,-1.35; P$8 0,-1.35; P$9 0.4,-1.35; P$10 0.8,-1.35; P$16 0.8,1.35; P$17 0.4,1.35; P$18 0,1.35; P$19 -0.4,1.35; P$20 -0.8,1.35 | smd 1.6 x 1.6: P$21 0,0
SON50P200X300X60-10 = smd 1.16 x 0.26: 1 -0.785,1 | smd 1.01 x 0.26: 2 -0.86,0.5; 3 -0.86,0; 4 -0.86,-0.5; 5 -0.86,-1; 6 0.86,-1; 7 0.86,-0.5; 8 0.86,0; 9 0.86,0.5; 10 0.86,1
QFN14 = smd 0.85 x 0.28: 1 -1.725,-0.75; 7 1.725,-0.75; 8 1.725,0.75; 14 -1.725,0.75 | smd 0.28 x 0.85: 2 -1,-1.725; 3 -0.5,-1.725; 4 0,-1.725; 5 0.5,-1.725; 6 1,-1.725; 9 1,1.725; 10 0.5,1.725; 11 0,1.725; 12 -0.5,1.725; 13 -1,1.725 | smd 2 x 2: TH_PAD 0,0
SOT95P280X145-5N = smd 1.27 x 0.559: 1 -1.295,0.94; 2 -1.295,0; 3 -1.295,-0.94; 4 1.295,-0.94; 5 1.295,0.94
SEPS_BB = drill 1.016 pad 1.88: 5V -6.35,-30.48; AREF -19.05,17.78; BUTTON1 15.24,17.78; BUTTON2 12.7,17.78; BUTTON3 10.16,17.78; BUTTON4 7.62,17.78; DIO1-RESET -11.43,-30.48; GND -3.81,-30.48; GND@1 -1.27,-30.48; GND@2 -16.51,17.78; LED1 5.08,17.78; LED2 2.54,17.78; LED3 -1.27,17.78; LED4 -3.81,17.78; NC 1.27,-30.48; PO.03 6.35,-30.48; PO.04 8.89,-30.48; PO.11 20.32,17.78; PO.12 17.78,17.78; PO.22(CTS)-DIO18(RTS) -6.35,17.78; PO.23(RTS)-DIO19(CTS) -8.89,17.78; PO.24(TX)-DIO2(RX) -11.43,17.78; PO.25(RX)-DIO3(TX) -13.97,17.78; PO.28 11.43,-30.48; PO.29 13.97,-30.48; PO.30 16.51,-30.48; PO.31 19.05,-30.48; SCL_FG -24.13,17.78; SDA_FG -21.59,17.78; VDD -16.51,-30.48; VDD@1 -13.97,-30.48; VDD@2 -8.89,-30.48
1X01@2 = drill 1.016 pad 1.88: 1 0,0

### Placement (x,y rotation side)
AND  52.01,49.84 180 top
BAT3  11.38,23.29 0 top
BATD/CD  13.29,19.71 180 top
BATT  4.27,15.11 90 top
BATT_TEST  7.82,13.82 90 top
C1  17.1,29.31 270 top
C2  23.16,29.31 270 top
C3  31.46,10.92 90 top
C4  55.11,19.27 270 top
C5  38.08,23.98 0 top
C6  45.56,24.84 90 top
C8  59.24,23.18 180 top
C9  60.18,20.1 270 top
C10  44.02,29.92 180 top
C11  38.91,28.6 0 top
C12  26.6,22.92 90 top
C14  61.21,33.59 270 top
C15  60.19,37.13 270 top
C16  60.19,40.73 90 top
C20  28.78,14.54 180 top
C24  65.65,46.35 90 top
C25  50.3,40.66 270 top
C26  50.3,46.05 90 top
D5  44.91,32.64 0 top
DNM  50.3,23.31 90 top
DNM1  47.81,24.84 90 top
DNM2  47.59,28.67 270 top
FT230XQ-R  58.47,46.93 0 top
IN_HV  34.14,25.96 0 top
J2  69.78,39.18 90 top
L1  62.92,36.38 180 top
L2  26.6,25.87 0 top
LX  38.3,20.06 90 top
Q1  59.75,28.76 270 top
R1  28.78,17.49 0 top
R2  34.07,10.92 270 top
R4  52.78,19.27 270 top
R5  54.37,16 180 top
R6  68.72,46.35 270 top
R9  52.77,23.31 270 top
R10  37.52,10.92 90 top
R11  54.28,11.45 0 top
R12  32.1,21.63 270 top
R15  36.65,49.63 0 top
R16  40.42,49.63 180 top
R17  28.36,10.91 270 top
R18  15.63,17.53 180 top
R19  21.4,17.44 180 top
R20  54.31,13.89 0 top
R21  14.75,29.31 90 top
R22  17.1,24.83 90 top
R23  57.25,37.58 0 top
R24  55.46,27.76 180 top
R25  53.9,32.42 270 top
R26  50.97,36.52 0 top
R27  68.89,49.83 0 top
R28  65.14,49.83 0 top
R29  57.25,40.62 180 top
R30  47.58,10.03 90 top
R31  51.26,10.06 90 top
RB2  4.7,26.04 180 top
RCG  13.63,13.08 90 top
REG_OUT  18.65,42.13 90 top
RLED1  37.14,35.1 0 top
RPROG1  41.43,34.75 180 top
RTPS1  21.4,20.7 0 top
RTPS2  24.13,20.49 270 top
RTPS3  17.1,20.97 90 top
RX  61.42,56.55 180 top
RX_TX  67.16,24.04 270 top
SCL  15.91,53.74 0 top
SCL_SDA  46.66,49.58 180 top
SDA  8.01,53.74 180 top
SOLAR_CON  2.87,38.94 90 bottom
SOLAR_JACK  -2.97,29.5 270 top
SPV1050  48.62,18.34 90 top
STC3115  23.59,13.17 180 top
STORE  34.14,29.77 0 top
TPS62737  21.16,24.28 270 top
TX  66.85,56.55 0 top
U4  39.22,31.85 0 top
U$1  48.01,35.56 0 top
VDD_CH  34.14,37.39 0 top

### Tracks (layer width: path | path; a pad name or v marks a point on that pad's centre or on a via)
ALM_FG  (via drill 0.47)
  Top 0.27: v26.07,11.86 25.75,12.17 STC3115.1 | R1.1 27.84,17.6 24.17,17.6 22.68,19.09 16.16,19.09 15.77,19.48 v15.77,19.99
  Bottom 0.254: 25.72,11.51 21.9,11.51 21.49,11.1 20.22,11.1 20.16,11.17
  Bottom 0.27: RB2.DIO22 18.8,54.07 17.64,55.23 4.62,55.23 4.08,54.69 4.08,48.29 15.77,36.6 v15.77,19.99 15.77,17.49 15.77,17.29 15.77,15.58 20.16,11.19 20.16,11.17 | v26.07,11.86 25.72,11.51
BATT_CH  (via drill 0.6)
  Top 0.175: 50.74,16.06 50.74,17.49 50.58,17.65 50.58,17.69 50.33,17.94 SPV1050.P$7
  Top 0.27: U$1.PO.30 64.52,5.82 64.01,6.32 62.75,6.32 61.67,7.41 47.58,7.41 R30.1 45.85,9.13 v45.85,9.17 | 50.74,16.06 50.32,16.06 v45.73,11.47
  Bottom 0.27: v45.85,9.17 45.73,9.28 v45.73,11.47
BATT_CONN  (via drill 0.6)
  Top 0.175: 50.98,18.34 SPV1050.P$8
  Top 0.27: U$1.PO.31 65.37,6.77 63.25,6.77 61.97,8.05 52.37,8.05 R31.1 49.83,9.15 49.71,9.27 v49.61,9.27 | v49.66,12.5 51.69,14.53 51.69,17.63 50.98,18.34
  Bottom 0.27: v49.61,9.27 49.61,12.45 v49.66,12.5
CHARGER_STAT1
  Top 0.27: U4.1 36.29,34.43 RLED1.1
DIO1-RESET  (via drill 0.47)
  Top 0.27: v22.98,39.79 22.98,41.69 20.58,44.09 v10.19,44.09 v10.18,44.1 | v32.4,18.06 37.52,12.94 R10.2
  Bottom 0.27: v32.4,18.06 29.78,20.69 29.78,31.69 22.98,38.49 v22.98,39.79 | v10.18,44.1 6.1,48.18 RB2.DIO1-RESET
DP4_UART_FTDI_TX  (via drill 0.47)
  Top 0.27: v63.19,46.39 63.19,47.78 60.27,50.69 58.64,50.69 58.14,50.2 FT230XQ-R.15 | RX_TX.1 65.09,25.34 65.09,25.45 65.08,25.46 v65.08,36.39
  Bottom 0.27: v65.08,36.39 65.08,44.5 v63.19,46.39
DP5_UART_FTDI_RX
  Top 0.27: FT230XQ-R.2 54.98,47.26 | AND.4 51.56,48.99 53.19,47.36 55.08,47.36 54.98,47.26 | 54.98,47.26 54.66,46.93 54.66,37.11 60.02,31.74 61.18,31.74 63.71,29.22 63.71,22.22 64.43,21.5 RX_TX.2
GND  (via drill 0.47, 0.47 pad 0.25, 0.5, 0.6, 0.8)
  Top 0.175: 48.62,19.4 48.62,19.5 SPV1050.P$13 48.62,18.29 v48.6,18.28 | SPV1050.P$5 SPV1050.P$6 | TPS62737.TH_PAD TPS62737.4 | SPV1050.P$18 46.1,18.34 45.73,18.7 44.46,18.7 v44.21,18.96
  Top 0.27: v21.67,24.79 v21.67,24.78 21.97,24.78 TPS62737.12 23.52,24.79 24.38,24.79 | 25.71,15.4 25.25,14.94 25.25,14.26 25.16,14.17 24.58,14.17 STC3115.5 24.45,14.92 24.24,15.12 | RTPS1.1 20.11,20.79
  Top 0.3: TPS62737.3 20.75,24.78
  Top 0.5: v59.08,47.59 59.08,48.04 59.45,48.41 FT230XQ-R.13 | FT230XQ-R.3 56.49,46.59 v57.78,46.59 58.12,46.93 FT230XQ-R.17 | 20.75,24.78 v20.77,24.8 | C12.2 25.64,23.82 24.67,24.79 24.38,24.79 | 20.11,20.79 v18.98,20.79 | TPS62737.14 21.91,24.84 21.97,24.78
  Top 1: RCG.2 15.56,13.98 16.7,15.12 24.24,15.12 | 25.71,15.4 24.43,16.68 23.82,16.68 v23.77,16.73
  Bottom 1: v18.98,20.79 23.04,16.73 v23.77,16.73
  other vias: 35.83,39.79 13.68,42.19 21.68,23.88 39.14,39.44 43.06,39.83 47.34,38.74 46.9,41.53 46.65,45.34 54.27,56.01 49.19,56.01 26.33,56.51 16.5,56.69 2.3,54.81 2.71,49.4 4.49,35.69 4.23,21.46 3.47,15.11 1.18,4.7 1.44,1.65 3.98,1.14 19.22,1.14 38.01,1.14 64.68,2.41 69,3.43 69.51,19.18 69.51,29.34 70.53,47.88 17.19,27.05 31.92,56.51 69.51,15.11 64.94,12.19 39.32,9.25 42.78,11.57 38.54,14.36 42.06,7.67 40.32,13.68 45.5,43.47 69.48,23.91 57.39,15.89 30.58,36.68 27.04,36.43 25.29,39.57 2.33,52.41 47.54,15.05 20.74,23.86 50.24,25.93 32.52,13.18 63.61,10.81 61.83,14.62 69.2,10.05 34.4,23 43.29,9.03
  pour Top: 71.28,57.79 0.88,57.79 0.88,0.99 71.28,0.99
  pour Bottom: 71.28,57.99 0.68,57.99 0.68,0.89 71.28,0.89
GPIO1
  Top 0.27: U$1.PO.03 52.89,3.61 4.38,3.61 4.38,6.79 5.21,7.62 RB2.NC@3
GPIO2
  Top 0.27: RB2.NC@2 8.64,8.83 8.5,8.97 4.58,8.97 3.8,8.19 3.8,3.09 54.91,3.09 U$1.PO.04
GPIO3
  Top 0.27: RB2.NC@1 11.18,9.09 10.68,9.59 3.58,9.59 2.88,8.89 2.88,2.61 56.97,2.61 U$1.PO.28
GPIO4
  Top 0.27: RB2.NC 13.72,9.45 12.98,10.19 2.48,10.19 2.3,10.01 2.3,2.16 2.43,2.04 58.94,2.04 U$1.PO.29
MPP_SET_ON
  Top 0.27: R11.2 55.85,12.12 55.85,13.26 R20.2
N$1  (via drill 0.47)
  Top 0.27: v61.63,48.06 60.83,47.26 FT230XQ-R.11
  Top 0.5: v62.28,50.89 62.98,50.18 63.88,50.18 R28.1
  Bottom 0.5: v62.28,50.89 62.28,48.71 v61.63,48.06
N$2
  Top 0.5: J2.1 65.32,37.88 L1.1 61.93,34.49 C14.1
N$3
  Top 0.27: C8.2 56.92,23.18 50.35,29.75 50.35,34.4 51.81,35.86 51.87,35.86 R26.2 51.87,36.29 53.9,34.25 R25.1 54.61,33.32 58.22,29.71 Q1.1
N$4
  Top 0.27: RTPS2.1 23.08,21.39 TPS62737.8 22,22.47 RTPS1.2
N$5  (via drill 0.47)
  Top 0.27: v18.38,17.59 16.59,17.59 R18.1 | STC3115.8 21.69,13.17 20.76,12.24 v20.24,12.24
  Bottom 0.27: v20.24,12.24 arc-90 19.18,13.3 19.18,16.79 v18.38,17.59
N$6
  Top 0.27: R22.1 17.25,23.78 TPS62737.5
N$7
  Top 0.175: 44.7,20.69 46.26,19.14 SPV1050.P$16
  Top 1: 44.7,20.69 39.19,20.69 LX.2
N$8  (via drill 0.6)
  Top 0.175: v45.96,13.86 46.82,14.73 46.82,16 SPV1050.P$1
  Top 0.27: R20.1 52.48,13.89 v52.01,13.42 | v45.96,13.86 43.67,13.86 42.28,15.24 42.16,15.37 42.01,15.37 37.06,15.37 32.1,20.33 R12.2
  Bottom 0.27: v52.01,13.42 46.39,13.42 v45.96,13.86
N$9
  Top 0.175: SPV1050.P$19 45.19,17.94 45.18,17.95
  Top 0.5: 45.18,17.95 38.88,17.95 LX.1
N$10
  Top 0.27: R21.1 14.75,23.51 15.48,22.79 18.94,22.79 TPS62737.6
N$11  (via drill 0.47)
  Top 0.27: TPS62737.13 23.08,25.28 23.08,25.38 | 23.08,25.38 23.78,25.38 | TPS62737.2 18.58,26.14 v18.58,27.79 | 23.08,25.38 23.08,26.07 v23.49,26.48
  Top 0.5: 23.78,25.38 24.27,25.87 L2.P$1
  Bottom 0.27: v18.58,27.79 22.18,27.79 v23.49,26.48
N$12
  Top 0.27: SCL.1 11.58,53.74 RB2.SCL_FG
N$14  (via drill 0.47)
  Top 0.27: v56.58,43.99 57.49,44.91 FT230XQ-R.5 | R27.1 66.68,48.48 v64.77,48.48
  Bottom 0.27: v56.58,43.99 56.58,44.59 | 56.58,44.59 | 56.58,44.59 | 56.58,44.59 56.58,44.99 57.18,45.59 59.38,45.59 59.88,46.09 59.88,46.89 60.9,46.89 61.18,47.17 63.34,47.17 64.65,48.48 v64.77,48.48
N$17
  Top 0.27: U4.5 42.28,34.56 RPROG1.1
N$18
  Top 0.27: R6.2 67.46,44.19 64.98,44.19 arc90 63.78,42.99 63.78,41.09 arc90 65.03,39.83 J2.4
N$20  (via drill 0.47)
  Top 0.27: RX.C arc90 60.5,56.69 58.98,56.69 arc90 58.68,56.39 v58.68,55.59 | v69.65,55.59 69.65,55.49 70.15,54.99 70.15,51.65 69.68,51.18 67.39,51.18 R28.2
  Bottom 0.27: v69.65,55.59 v58.68,55.59
N$21
  Top 0.27: R10.1 37.52,6.03 U$1.DIO1-RESET
N$22
  Top 0.27: TPS62737.7 19.72,21.87 RTPS3.2
N$23
  Top 0.27: SDA.3 7,51.7 RB2.SDA_FG
N$24
  Top 0.27: R27.2 69.79,50.59 70.62,51.42 70.62,56.06 70.13,56.55 TX.C
N$25
  Top 0.2: 13.3,18.67 13.3,19.7
  Top 0.27: R18.2 14.44,17.53 13.3,18.67 | 13.3,19.7 BATD/CD.2
N$26
  Top 0.27: TPS62737.9 24.18,23.28 25.28,22.19 25.28,19.59 RTPS2.2 22.63,19.59 22.6,19.57 18.98,19.57 18.48,20.07 RTPS3.1
N$27
  Top 0.27: SDA.1 10.43,55.14 25.05,55.14 26.42,53.77 U$1.SDA_FG
N$28
  Top 0.27: SCL.3 23.47,53.74 U$1.SCL_FG
N$29
  Top 0.27: BAT3.1 14.31,20.36 BATD/CD.1 14.41,19.71 15.53,18.59 21.48,18.59 22.3,17.76 R19.1
N$30
  Top 0.27: RLED1.2 39,36.12 43.03,36.12 44.91,34.24 D5.C
N$31
  Top 0.175: FT230XQ-R.7 58.79,45.26 58.4,45.65 57.13,45.65 56.57,45.09
  Top 0.27: 56.57,45.09 55.67,45.09 55.38,44.79 55.38,39.09 arc65 R23.1
N$32
  Top 0.27: R29.2 56.39,41.9 56.68,42.19 arc90 58.14,43.66 FT230XQ-R.6
N$33  (via drill 0.47)
  Top 0.27: v55.48,49.59 56.84,49.59 FT230XQ-R.16 | v53.88,46.59 53.98,46.49 53.98,36.58 59.47,31.09 61.06,31.09 62.49,29.67 62.49,20.45 63.97,18.96 RX_TX.3
  Bottom 0.27: v53.88,46.59 53.88,47.99 v55.48,49.59
N$34  (via drill 0.47)
  Top 0.27: v24.92,10.77 24.13,10.77 STC3115.10 | R17.2 C3.1
  Top 0.5: v26.95,9.73 27.23,10.01 R17.2
  Bottom 0.5: v26.95,9.73 25.95,9.73 v24.92,10.77
N$35  (via drill 0.47)
  Top 0.27: v53.18,44.99 53.18,36.31 58.99,30.49 60.93,30.49 61.73,29.69 61.73,18.02 63.34,16.42 RX_TX.4 | v55.42,45.95 FT230XQ-R.4
  Bottom 0.27: v53.18,44.99 54.46,44.99 v55.42,45.95
N$40
  Top 0.175: 50.49,20.17 49.97,19.65 SPV1050.P$10
  Top 0.27: R4.1 55.1,20.16 C4.1 | R4.1 52.77,20.19 R9.2 | R4.1 51.67,20.17 50.49,20.17
N$41
  Top 0.175: SPV1050.P$9 52.42,18.74 52.88,18.28
  Top 0.27: R4.2 52.88,18.28 53.47,17.69 R5.2
N$44
  Top 0.175: SPV1050.P$11 49.54,19.81 49.54,21.65
  Top 0.27: DNM.1 49.54,21.65
N$45
  Top 0.175: 49.02,22.73 SPV1050.P$12
  Top 0.27: DNM1.1 49.02,22.73
NO_SIGNAL
  cutout Bottom: 43.68,41.89 43.68,40.69 22.28,40.69 22.28,44.49 43.68,44.49
  cutout Bottom: 68.18,34.59 62.98,34.59 62.98,26.39 68.48,26.39 68.48,34.59
PO.22(CTS)-DIO18(RTS)  (via drill 0.47)
  Top 0.27: v14.78,36.19 16.18,37.59 28.38,37.59 35.86,45.07 v35.86,45.11
  Bottom 0.27: v14.78,36.19 14.78,36.79 12.28,39.29 12.18,39.29 arc90 11.48,38.59 11.48,36.39 13.36,34.51 13.36,21.39 11.78,21.39 10.98,20.59 10.98,12.69 12.58,11.09 16.55,11.09 18.8,8.84 RB2.PO.22(CTS)-DIO18(RTS) | v35.86,45.11 35.86,46.53 40.89,51.57 40.89,51.56 41.66,52.32 U$1.PO.22(CTS)-DIO18(RTS)
PO.23(RTS)-DIO19(CTS)  (via drill 0.47)
  Top 0.27: v34.48,45.29 27.78,38.59 13.38,38.59 v12.48,37.69
  Bottom 0.27: U$1.PO.23(RTS)-DIO19(CTS) 37.55,51.77 36.36,51.77 34.48,49.89 v34.48,45.29 | v12.48,37.69 12.74,37.69 14,36.43 14,16.57 20.69,9.87 21.34,9.23 RB2.PO.23(RTS)-DIO19(CTS)
PO.24(TX)-DIO2(RX)
  Top 0.27: U$1.PO.24(TX)-DIO2(RX) 38.33,51.59 51.78,51.59 52.01,51.35 AND.2
  Bottom 0.27: U$1.PO.24(TX)-DIO2(RX) 35.03,54.89 22.88,54.89 21.34,53.35 RB2.PO.24(TX)-DIO2(RX)
PO.25(RX)-DIO3(TX)
  Top 0.27: U$1.PO.25(RX)-DIO3(TX) 35.69,54.99 46.96,54.99 49.89,52.06 52.1,52.06 52.66,51.5 AND.1
  Bottom 0.27: RB2.PO.25(RX)-DIO3(TX) 24.72,51.64 25.15,52.07 32.78,52.07 U$1.PO.25(RX)-DIO3(TX)
PWR_EN#  (via drill 0.47)
  Top 0.27: v60.06,49.82 58.82,49.82 58.82,49.72 58.79,49.72 FT230XQ-R.14 | v52.44,46.8 52.43,46.79 52.43,39.67 50.07,37.31 R26.1
  Bottom 0.27: v60.06,49.82 59.39,50.49 55.09,50.49 52.44,47.84 v52.44,46.8
RCG
  cutout Top: 13.54,13.42 15.95,13.42 17.05,14.52 24.14,14.52 24.14,13.96 24.16,13.98 24.83,13.98 24.83,15.49 24.79,15.53 24.51,15.81 16.49,15.81 15.32,14.64 12.7,14.64 12.7,13.42
RSTIO_FG
  Top 0.27: STC3115.7 22.63,13.67 21.48,13.67 20.82,13.02 17.92,13.02 16.26,11.35 16.26,7.65 RB2.RESET 17.51,8.87 32.92,8.87 R2.2
SCL_FG  (via drill 0.47)
  Top 0.27: STC3115.3 25.46,13.17 26.16,13.87 v26.16,14.14 | SCL.2 15.91,53.25 17.11,52.06 32.21,52.06 34.63,49.63 R15.1 35.75,50.18 36.68,51.1 42.6,51.1 SCL_SDA.2 | v15.58,45.49 16.14,46.05 40.34,46.05 41.48,47.19 v41.68,47.19
  Bottom 0.27: v15.58,45.49 15.58,45.19 16.68,44.09 16.68,35.79 21.78,30.69 21.78,29.29 26.98,24.09 26.98,14.96 v26.16,14.14 | SCL_SDA.2 42.53,47.19 v41.68,47.19
SDA_FG  (via drill 0.47)
  Top 0.27: SCL_SDA.1 45.28,47.43 43.58,47.43 41.33,49.69 R16.1 41.33,48.06 39.8,46.54 5.53,46.54 | 5.53,46.54 4.58,47.5 4.58,54.49 5.28,55.19 7.58,55.19 8.01,54.75 SDA.2 | STC3115.2 26.27,12.67 v26.77,13.17 | v20.62,40.06 20.4,40.29 11.79,40.29 5.53,46.54
  Bottom 0.27: v20.62,40.06 20.62,40.04 29.18,31.49 29.18,17.89 28.17,16.88 28.17,14.57 v26.77,13.17
STC
  cutout Top: 23.32,14.48 23.32,11.91 23.39,11.84 23.42,11.81 23.73,11.81 23.75,11.84 23.75,12.5 23.75,13.87 23.9,14.02 23.9,14.48 23.88,14.5 23.34,14.5
  cutout Bottom: 23.32,14.48 23.32,11.91 23.39,11.84 23.42,11.81 23.73,11.81 23.75,11.84 23.75,12.5 23.75,13.87 23.9,14.02 23.9,14.48 23.88,14.5 23.34,14.5
STORE  (via drill 0.6)
  Top 0.175: 47.23,20.03 47.48,20.03 SPV1050.P$15
  Top 0.406: R31.2 51.68,10.96 53.44,9.19 58.52,9.19 59.03,9.7
  Top 0.5: 20.41,28.21 TPS62737.1
  Top 0.813: 47.11,29.57 45.66,28.12 45.66,28.09 v43.61,26.04 | v43.61,24.43 v43.62,24.42
  Top 1: 47.11,29.57 DNM2.1 48.68,29.57 52.77,25.48 R9.1 54.43,24.21 57.25,21.39 57.25,19.1 59.03,17.32 59.03,9.7 | v43.61,26.04 v43.61,24.43 | 47.23,20.03 45.56,21.7 C6.1 44.11,23.94 v43.62,24.42 | R30.2 47.61,10.96 50.22,10.96 R31.2
  Top 1.5: 20.41,28.21 21.94,29.74 C2.1 | C2.1 22.69,30.21 C1.1 14.8,30.21 R21.2 | C2.1 33.7,30.21 STORE.1
  Bottom 0.5: v43.61,24.43 v43.62,24.42
  Bottom 1: STORE.1 36.46,26.99 41.83,26.99 43.17,26.99 43.61,26.55 v43.61,24.43
USBD_N
  Top 0.27: R23.2 59.77,37.58 C15.1 61.73,38.03 62.24,38.53 J2.2
USBD_P
  Top 0.27: J2.3 62.4,39.18 62.01,39.57 62.02,39.57 61.76,39.83 C16.1 59.41,40.62 R29.1
V_SOLAR
  Top 0.175: 46.74,17.54 SPV1050.P$20
  Top 0.27: 46.74,17.54 45.28,16.07 37.17,16.07 34.64,18.6 34.64,19.99 R12.1
  Top 1: IN_HV.1 34.11,25.89 35.26,25.89 C5.1 | R12.1 32.1,24.02 IN_HV.1 | IN_HV.1 36.43,28.24 36.43,31.8 34.58,33.64 33.82,33.64
  Top 3: 10.6,36.19 13.14,33.64 33.82,33.64 | 10.6,36.19 4.35,42.44 SOLAR_CON.2 | SOLAR_JACK.PWR 10.73,36.06 10.6,36.19
VBAT  (via drill 0.35, 0.47, 0.6, 0.65)
  Top 0.175: v48.02,21.91 47.96,21.85 47.96,20.7 48.22,20.45 SPV1050.P$14
  Top 0.3: STC3115.9 22.11,12.67 21.25,11.8
  Top 0.5: 21.25,11.8 20.73,11.29 20.48,11.29 20.23,11.04
  Top 0.61: C11.1 38.06,30.77 U4.3
  Top 0.7: v12.08,16.29 13.02,16.29 18.55,16.29 19.7,17.44 R19.2
  Top 1: 20.23,11.04 21.44,11.04 21.44,11.03 22.78,9.69 24.03,9.69 25.4,9.69 27.52,11.81 R17.1 28.32,11.85 28.32,12.47 29.82,13.97 29.82,14.57 | v12.08,16.29 13.02,16.29 13.04,16.29 v14.07,15.26 | 20.23,11.04 20.05,11.04 19.16,10.15 v17.81,11.51 | 20.23,11.04 | v31.15,14.57 30.22,14.57 29.82,14.57 | C20.1 29.72,14.57 29.82,14.57 | C11.1 38.06,26.35 38.46,25.96 40.49,25.96 41.76,24.69 v41.76,21.91
  Top 2: v12.08,16.29 7.89,16.29 | 7.89,16.29 BATT_TEST.2 | BATT.2 7.97,16.21 7.89,16.29
  Bottom 1: v12.08,16.29 12.15,16.36 12.96,16.36 v17.81,11.51 v19.12,10.19 | v48.02,21.91 v41.76,21.91 40.94,21.91 33.61,14.57 v31.15,14.57
VBAT-
  Top 0.27: STC3115.6 20.78,14.16
  Top 0.5: 20.48,13.86 20.78,14.16
  Top 1: BATT_TEST.1 7.82,13.97 BATT.1 | RCG.1 15.75,12.18 17.43,13.86 20.48,13.86
  Top 1.5: 9.9,12.18 BATT.1
  Top 2: RCG.1 9.9,12.18
VCC_FTDI  (via drill 0.47, 0.6)
  Top 0.27: FT230XQ-R.10 61.31,46.61
  Top 0.813: 61.31,46.61 v62.5,45.42
  Top 1: R25.2 55.04,31.52 Q1.2 | R25.2 52.44,31.52 51.52,32.44 v51.52,33.17 v52.57,34.22 | R24.2 53.9,28.43 R25.2 | L1.2 62.03,36.78 v62.92,37.67 | C25.1 50.28,42 v51.49,43.21 50.3,44.4 C26.1
  Bottom 1: v61.59,46.33 v62.5,45.42 62.53,45.39 60.71,43.58 | 54.01,43.8 55.05,42.76 59.89,42.76 60.71,43.58 | v51.52,33.17 51.52,33.19 54.07,35.75 54.07,43.73 54.01,43.8 | v62.92,37.67 62.92,41.38 62.38,41.91 60.71,43.58 | 54.01,43.8 52.08,43.8 v51.49,43.21
VCCIO_FTDI
  Top 0.27: 69.26,51.85 arc90 69.68,52.27 69.68,54.59 arc90 69.48,54.79 66.68,54.79 66.11,55.36 66.11,56.42 TX.A RX.A
  Top 0.5: FT230XQ-R.1 55.64,47.91 54.64,48.91 | AND.5 54.56,48.99 54.64,48.91 | 59.98,51.85 69.26,51.85 | C24.1 63.91,45.43 | FT230XQ-R.8 FT230XQ-R.9 62.04,44.39 62.86,44.39 63.91,45.43 | 59.98,51.85 64.11,47.73 64.11,45.63 63.91,45.43 | 59.98,51.85 59.58,51.85 59.18,51.85 55.64,51.85 54.54,50.75 54.54,49.01 54.64,48.91
VDD  (via drill 0.35, 0.47)
  Top 0.27: 24.48,23.89 24.08,23.89 23.68,24.28 TPS62737.11
  Top 0.5: 36.98,47.66 37.55,48.24 R15.2 | R16.2 39.46,49.63 | 24.48,23.89 26.35,22.02 C12.1
  Top 1: R15.2 39.46,49.63 | v25.68,27.89 26.98,27.89 27.6,27.26 L2.P$2 27.83,25.37 28.15,25.05 28.15,21.99 | C12.1 28.12,22.02 28.15,21.99 | 28.15,21.99 29.75,20.39 R1.2 30.83,17.49 34.07,14.25 R2.1 34.65,11.82 35.68,10.79 35.68,9.26 34.44,8.02 U$1.VDD
  Top 1.5: 36.98,47.66 34.77,47.66 31.53,50.9 29.06,50.9 RB2.VDD
  Bottom 1: v27.02,27.88 27.01,27.89 v25.68,27.89
  Bottom 1.5: RB2.VDD 29.47,50.8 31.08,49.19 31.08,45.59 30.78,45.29 18.42,45.29 18.42,42.2 REG_OUT.1 18.65,39.34 18.74,39.33 25.68,32.4 v25.68,27.89
VDD_CHARGER  (via drill 0.6)
  Top 0.27: 47.83,32.88 v47.83,32.98 | C10.1 44.87,31.72 D5.A 41.37,31.76 U4.4
  Top 0.5: C8.1 60.86,23.89 Q1.3
  Top 0.61: C10.1 47.83,32.88
  Top 1: R24.1 57.66,26.47 v57.66,25.25 58.23,25.25 60.14,23.34 C8.1 60.18,23.14 C9.1
  Top 1.5: VDD_CH.1 34.1,37.3 38.58,37.3 43.49,37.3 v43.75,37.05 45.75,35.04 46.29,34.5 46.3,34.5 v47.83,32.98
  Bottom 1.5: v43.75,37.05 55.55,25.25
  Bottom 2: 55.55,25.25 v57.66,25.25

### Text on the board
tPlace: + | + | + | RTS | CTS | - | GPIO1 | GPIO2 | GPIO3 | GPIO4
tDocu: Ghobrial Ramez